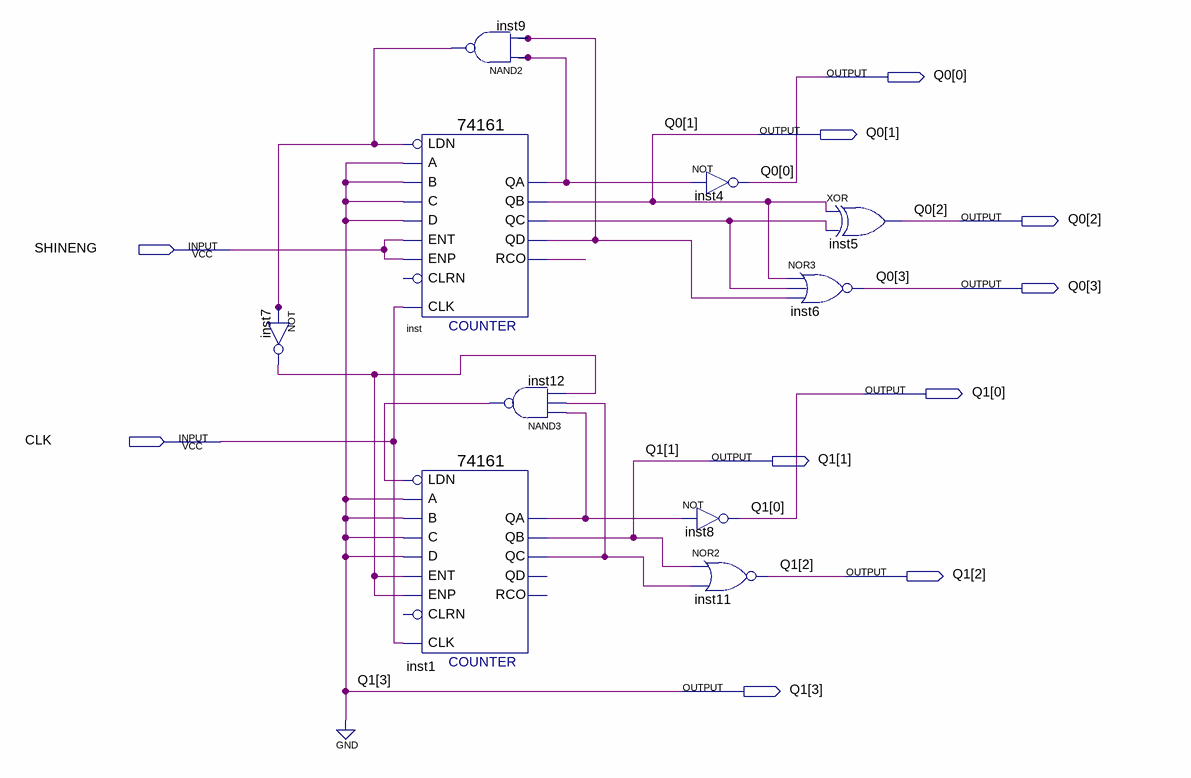
[diagram p0: schematic sheet]
// Quartus schematic green.bdf as structural Verilog: 10 symbols, 10 pins
module green (
  input  SHINENG,
  input  CLK,
  output [3:0] Q0,
  output [3:0] Q1
);

  wire inst1_qa, inst1_qc, inst7_out, inst9_out, inst12_out, inst_qa, inst_qc, inst_qd, inst_rco;

  not inst7 (inst7_out, inst9_out);
  \74161  inst (
    .CLK(CLK), .ENP(SHINENG), .LDN(inst9_out), .A(1'b0), .D(1'b0), .ENT(SHINENG), .B(1'b0), .C(1'b0),
    .QD(inst_qd), .QC(inst_qc), .QB(Q0[1]), .QA(inst_qa), .RCO(inst_rco));  // open: CLRN
  \74161  inst1 (
    .CLK(CLK), .ENP(inst7_out), .LDN(inst12_out), .A(1'b0), .D(1'b0), .ENT(inst7_out), .B(1'b0), .C(1'b0),
    .QC(inst1_qc), .QB(Q1[1]), .QA(inst1_qa));  // open: CLRN, QD, RCO
  nand inst9 (inst9_out, inst_qa, inst_qd);
  nand inst12 (inst12_out, inst1_qa, inst1_qc, inst7_out);
  not inst4 (Q0[0], inst_qa);
  not inst8 (Q1[0], inst1_qa);
  nor inst11 (Q1[2], Q1[1], inst1_qc);
  xor inst5 (Q0[2], Q0[1], inst_qc);
  nor inst6 (Q0[3], Q0[1], inst_qc, inst_qd);

  assign Q1[3] = 1'b0;
endmodule
